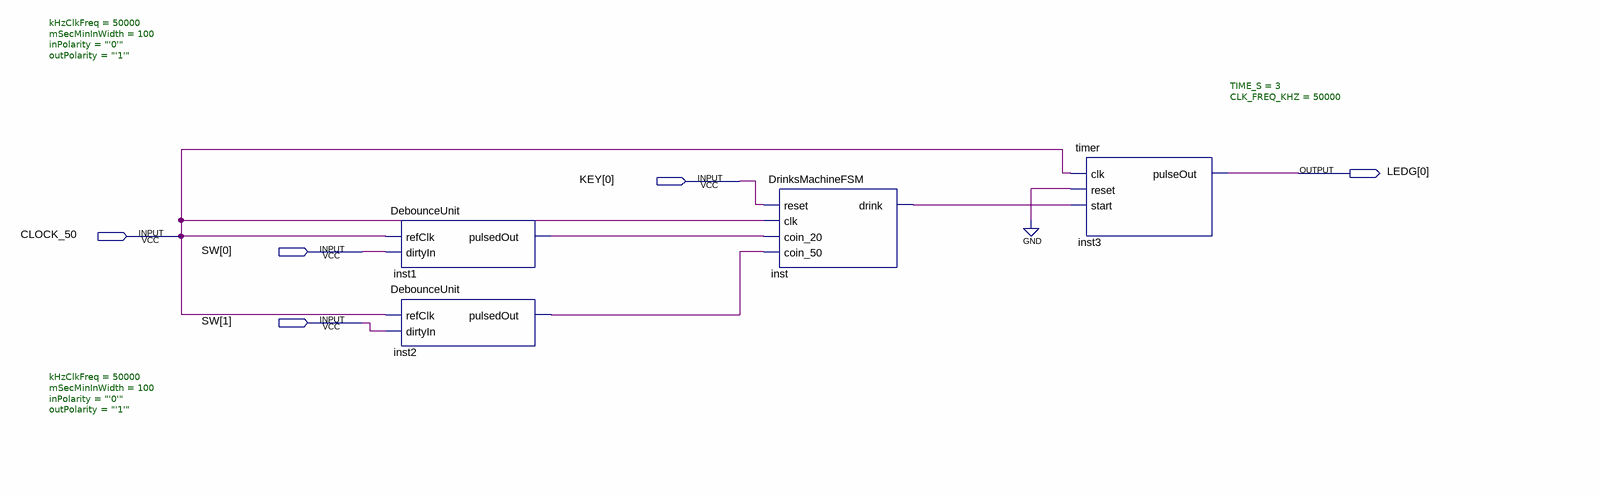
[diagram p0: schematic sheet]
// Quartus schematic DrinksMachine.bdf as structural Verilog: 4 symbols, 5 pins
module DrinksMachine (
  input  [0:0] KEY,
  input  CLOCK_50,
  input  [1:0] SW,
  output [0:0] LEDG
);

  wire inst1_pulsedout, inst2_pulsedout, inst_drink;

  DebounceUnit #(.kHzClkFreq(50000), .mSecMinInWidth(100), .inPolarity("'0'"), .outPolarity("'1'")) inst1 (
    .refClk(CLOCK_50), .dirtyIn(SW[0]), .pulsedOut(inst1_pulsedout));
  DebounceUnit #(.kHzClkFreq(50000), .mSecMinInWidth(100), .inPolarity("'0'"), .outPolarity("'1'")) inst2 (
    .refClk(CLOCK_50), .dirtyIn(SW[1]), .pulsedOut(inst2_pulsedout));
  DrinksMachineFSM inst (
    .reset(KEY[0]), .clk(CLOCK_50), .coin_20(inst1_pulsedout), .coin_50(inst2_pulsedout), .drink(inst_drink));
  timer #(.TIME_S(3), .CLK_FREQ_KHZ(50000)) inst3 (
    .clk(CLOCK_50), .reset(1'b0), .start(inst_drink), .pulseOut(LEDG[0]));
endmodule
